# Altium schematic sheet cm_filter_ch0_b.SchDoc: Common Mode Filter CH0 B
size A4; Date: 2015-02-21; Author: Piotr Kuligowski; Revision: 1-0; SheetNumber: 7; SheetTotal: 8; Model: EM1
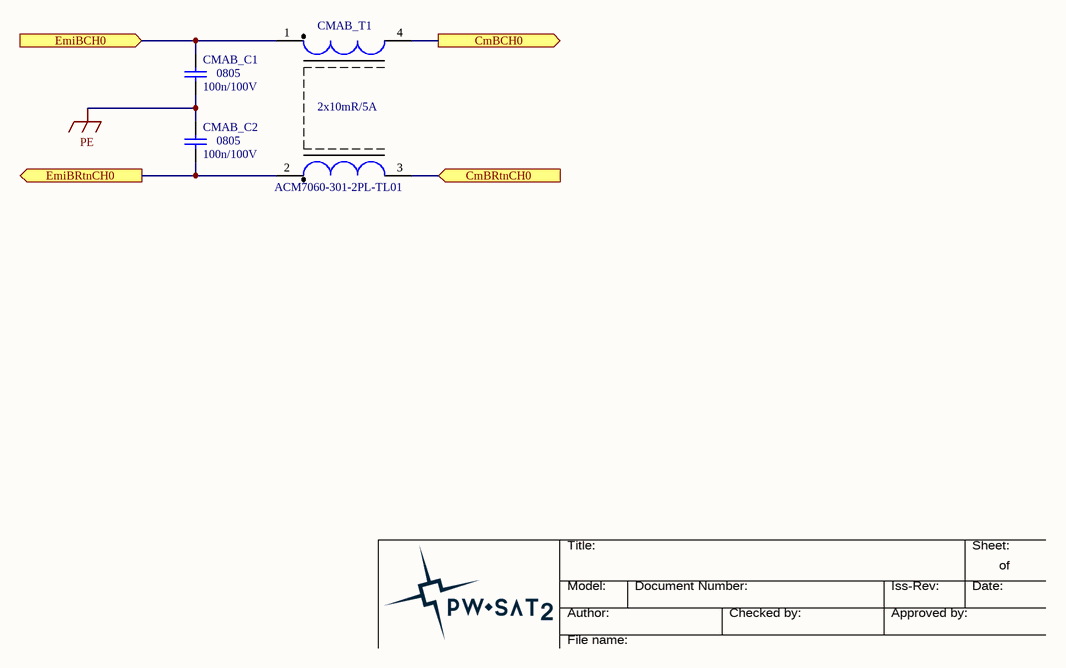
[diagram p0: cm_filter_ch0_b.SchDoc]

## Parts
CMAB_C1  Package: 0805  [SMD_Capacitor_0805]  (hidden comment: 100n/100V)
CMAB_C2  Package: 0805  [SMD_Capacitor_0805]  (hidden comment: 100n/100V)
CMAB_T1  2x10mR/5A  [TDK_ACM7060]

## Ports
CmBCH0 (out), CmBRtnCH0 (in), EmiBCH0 (in), EmiBRtnCH0 (out)

## Nets
PE: CMAB_C1.2 CMAB_C2.1
CmBCH0: CMAB_T1.4 ; port CmBCH0
CmBRtnCH0: CMAB_T1.3 ; port CmBRtnCH0
EmiBCH0: CMAB_C1.1 CMAB_T1.1 ; port EmiBCH0
EmiBRtnCH0: CMAB_C2.2 CMAB_T1.2 ; port EmiBRtnCH0

## Notes on the sheet
- Title:
- Sheet:
- of
- Author:
- Model:
- Document Number:
- Checked by:
- Iss-Rev:
- Approved by:
- Date:
- File name:

## Library data of the parts
CMAB_C1 CMAB_C2 = Cer_C0805T104K1RCLTU: Ceramic Cap Kemet COTS 100n/100V X7R 0805; ManufacturerPartNumber: C0805T104K1RCLTU; Manufacturer: Kemet; Value: 100n/100V
CMAB_T1 = ACM7060-301-2PL-TL01: TDK ACM7060-301 Common Mode Choke; Manufacturer: TDK; ManufacturerPartNumber: ACM7060-301-2PL-TL01; Value: 2x10mR/5A